# Altium schematic sheet Ignitor Outputs.SchDoc: Ravage - Ignitor Outputs
size A4; Address1: Drawn By:; Address2: Dan Visser; DocumentNumber: A; Revision: 0.1-alpha; SheetNumber: 10; SheetTotal: 16
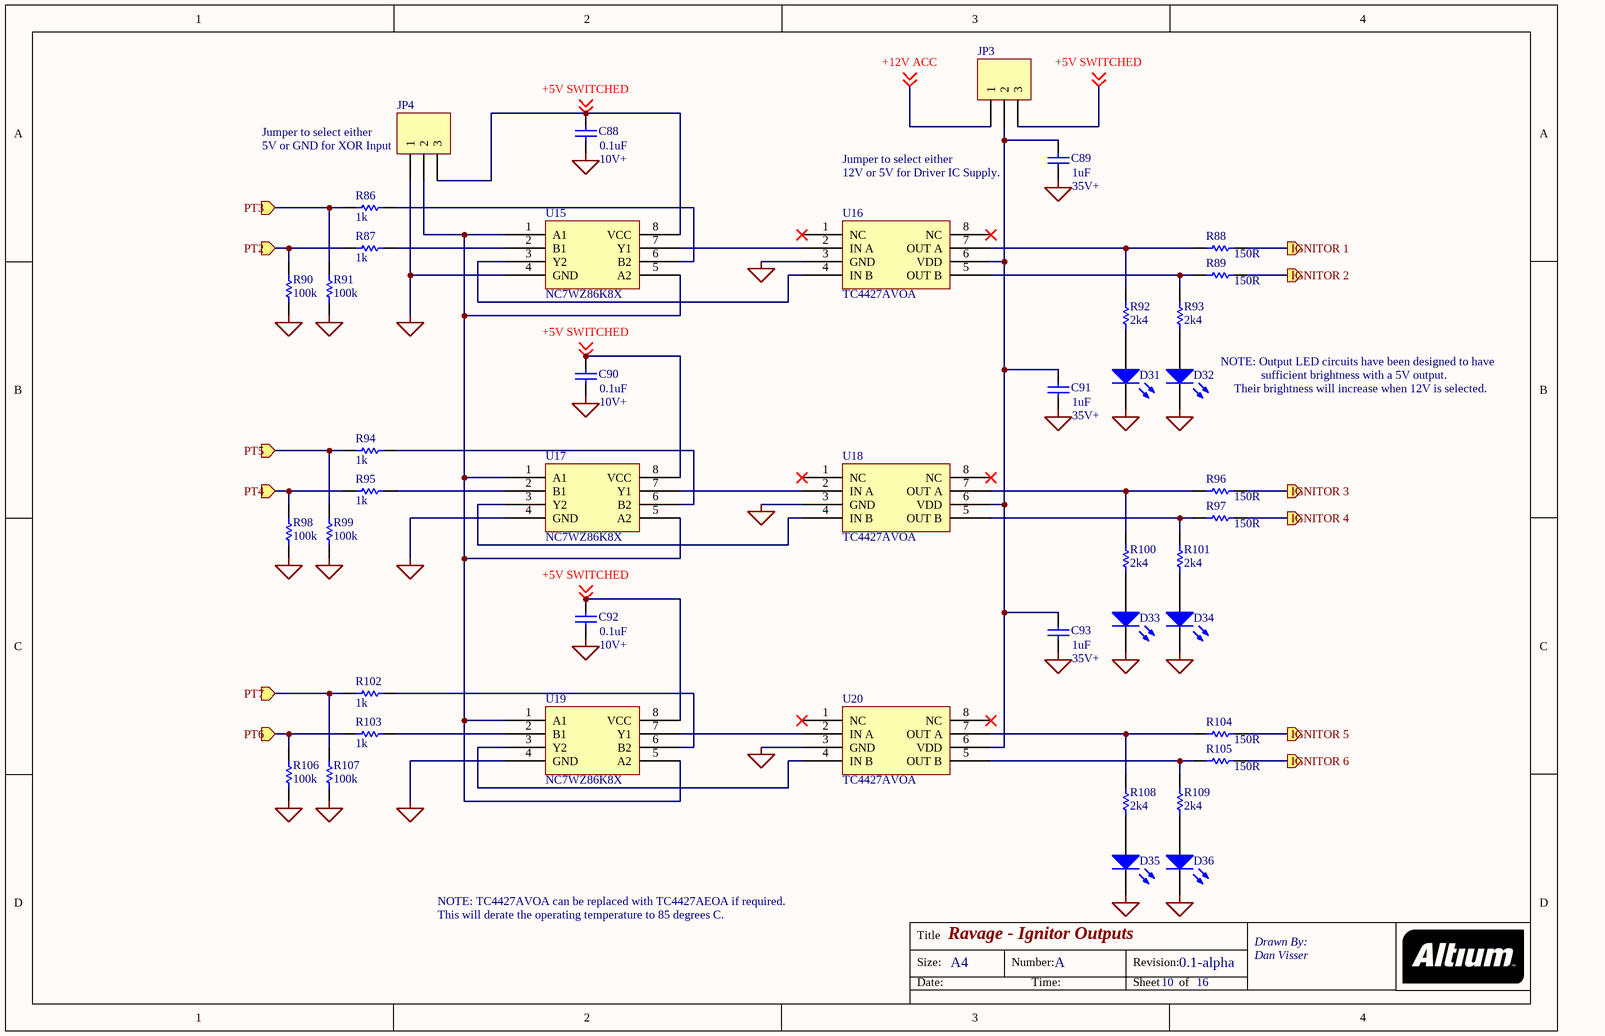
[diagram p0: Ignitor Outputs.SchDoc]

## Parts
C88  value 0.1uF  [RAD-0.3]
C89  value 1uF  [RAD-0.3]
C90  value 0.1uF  [RAD-0.3]
C91  value 1uF  [RAD-0.3]
C92  value 0.1uF  [RAD-0.3]
C93  value 1uF  [RAD-0.3]
D31  (no value)  [LED-0]
D32  (no value)  [LED-0]
D33  (no value)  [LED-0]
D34  (no value)  [LED-0]
D35  (no value)  [LED-0]
D36  (no value)  [LED-0]
JP3  (no value)  [HDR1X3]
JP4  (no value)  [HDR1X3]
R86  value 1k  [AXIAL-0.3]
R87  value 1k  [AXIAL-0.3]
R88  value 150R  [AXIAL-0.3]
R89  value 150R  [AXIAL-0.3]
R90  value 100k  [AXIAL-0.3]
R91  value 100k  [AXIAL-0.3]
R92  value 2k4  [AXIAL-0.3]
R93  value 2k4  [AXIAL-0.3]
R94  value 1k  [AXIAL-0.3]
R95  value 1k  [AXIAL-0.3]
R96  value 150R  [AXIAL-0.3]
R97  value 150R  [AXIAL-0.3]
R98  value 100k  [AXIAL-0.3]
R99  value 100k  [AXIAL-0.3]
R100  value 2k4  [AXIAL-0.3]
R101  value 2k4  [AXIAL-0.3]
R102  value 1k  [AXIAL-0.3]
R103  value 1k  [AXIAL-0.3]
R104  value 150R  [AXIAL-0.3]
R105  value 150R  [AXIAL-0.3]
R106  value 100k  [AXIAL-0.3]
R107  value 100k  [AXIAL-0.3]
R108  value 2k4  [AXIAL-0.3]
R109  value 2k4  [AXIAL-0.3]
U15  NC7WZ86K8X
U16  TC4427AVOA
U17  NC7WZ86K8X
U18  TC4427AVOA
U19  NC7WZ86K8X
U20  TC4427AVOA

## Ports
IGNITOR 1 (out), IGNITOR 2 (out), IGNITOR 3 (out), IGNITOR 4 (out), IGNITOR 5 (out), IGNITOR 6 (out), PT2 (in), PT3 (in), PT4 (in), PT5 (in), PT6 (in), PT7 (in)

## Nets
NetC88_1: C88.1 C89.1 C90.1 C91.1 C92.1 C93.1 D31.2(K) D32.2(K) D33.2(K) D34.2(K) D35.2(K) D36.2(K) JP4.1 R90.1 R91.1 R98.1 R99.1 R106.1 R107.1 U15.4(GND) U16.3(GND) U17.4(GND) U18.3(GND) U19.4(GND) U20.3(GND)
+5V SWITCHED: C88.2 C90.2 C92.2 JP3.3 JP4.3 U15.8(VCC) U17.8(VCC) U19.8(VCC) ; off-sheet +5V SWITCHED
+12V ACC: JP3.1 ; off-sheet +12V ACC
IGNITOR 1: R88.2 ; port IGNITOR 1
IGNITOR 2: R89.2 ; port IGNITOR 2
IGNITOR 3: R96.2 ; port IGNITOR 3
IGNITOR 4: R97.2 ; port IGNITOR 4
IGNITOR 5: R104.2 ; port IGNITOR 5
IGNITOR 6: R105.2 ; port IGNITOR 6
PT2: R87.2 R90.2 ; port PT2
PT3: R86.2 R91.2 ; port PT3
PT4: R95.2 R98.2 ; port PT4
PT5: R94.2 R99.2 ; port PT5
PT6: R103.2 R106.2 ; port PT6
PT7: R102.2 R107.2 ; port PT7
NetC89_2: C89.2 C91.2 C93.2 JP3.2 U16.6(VDD) U18.6(VDD) U20.6(VDD)
NetD31_1: D31.1(A) R92.1
NetD32_1: D32.1(A) R93.1
NetD33_1: D33.1(A) R100.1
NetD34_1: D34.1(A) R101.1
NetD35_1: D35.1(A) R108.1
NetD36_1: D36.1(A) R109.1
NetJP4_2: JP4.2 U15.1(A1) U15.5(A2) U17.1(A1) U17.5(A2) U19.1(A1) U19.5(A2)
NetR86_1: R86.1 U15.6(B2)
NetR87_1: R87.1 U15.2(B1)
NetR88_1: R88.1 R92.2 U16.7(OUT_A)
NetR89_1: R89.1 R93.2 U16.5(OUT_B)
NetR94_1: R94.1 U17.6(B2)
NetR95_1: R95.1 U17.2(B1)
NetR96_1: R96.1 R100.2 U18.7(OUT_A)
NetR97_1: R97.1 R101.2 U18.5(OUT_B)
NetR102_1: R102.1 U19.6(B2)
NetR103_1: R103.1 U19.2(B1)
NetR104_1: R104.1 R108.2 U20.7(OUT_A)
NetR105_1: R105.1 R109.2 U20.5(OUT_B)
NetU15_3: U15.3(Y2) U16.4(IN_B)
NetU15_7: U15.7(Y1) U16.2(IN_A)
NetU17_3: U17.3(Y2) U18.4(IN_B)
NetU17_7: U17.7(Y1) U18.2(IN_A)
NetU19_3: U19.3(Y2) U20.4(IN_B)
NetU19_7: U19.7(Y1) U20.2(IN_A)

Not connected (* = marked no-connect by the designer): U16 1(NC)* 8(NC)*; U18 1(NC)* 8(NC)*; U20 1(NC)* 8(NC)*

## Notes on the sheet
- (near JP4) Jumper to select either
- (near JP4) 5V or GND for XOR Input
- (near C88) 10V+
- Jumper to select either
- (near C89) 12V or 5V for Driver IC Supply.
- (near C89) 35V+
- NOTE: Output LED circuits have been designed to have
- sufficient brightness with a 5V output.
- (near C90) 10V+
- (near C91) 35V+
- Their brightness will increase when 12V is selected.
- (near C92) 10V+
- (near C93) 35V+
- NOTE: TC4427AVOA can be replaced with TC4427AEOA if required.
- This will derate the operating temperature to 85 degrees C.
- Title
- Size:
- Date:
- A4
- Number:
- Time:
- Revision:
- Sheet
- of

## Library data of the parts
C88-C93 = Cap: Capacitor; Published: 8-Jun-2000; LatestRevisionDate: 17-Jul-2002; LatestRevisionNote: Re-released for DXP Platform.; PackageReference: RAD-0.3; Publisher: Altium Limited; PackageDescription: Radial Cap, Thru-Hole; 2 Leads; 0.3 in Pin Spacing
D31-D36 = LED0: Typical INFRARED GaAs LED; Published: 8-Jun-2000; LatestRevisionDate: 08-Jul-2005; LatestRevisionNote: Mech Layer 1 removed.; PackageReference: LED-0; Publisher: Altium Limited; PackageDescription: LED; 2 Leads
JP3 JP4 = Header 3: Header, 3-Pin; LatestRevisionDate: 17-Jul-2002; LatestRevisionNote: Re-released for DXP Platform.; Publisher: Altium Limited
R86-R109 = Res1: Resistor; Published: 8-Jun-2000; LatestRevisionDate: 17-Jul-2002; LatestRevisionNote: Re-released for DXP Platform.; PackageReference: AXIAL-0.3; Publisher: Altium Limited; PackageDescription: Axial Device, Thru-Hole; 2 Leads; 0.3 in Pin Spacing
U16 U18 U20 = TC427COA